# Altium project Microphone-Boards.PrjPcb
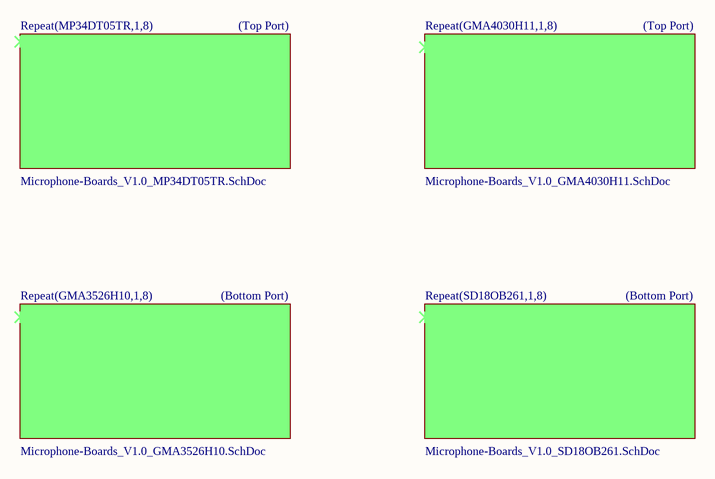
[diagram p0: Microphone-Boards_V1.0.SchDoc]
5 sheets, 320 parts. Net scope: hierarchical (ports join the sheet entries above them; power ports are global).
Board file: Microphone-Boards_V1.0.PcbDoc
Sheets:
  Microphone-Boards_V1.0.SchDoc
    MP34DT05TR1 = Microphone-Boards_V1.0_MP34DT05TR.SchDoc
    MP34DT05TR2 = Microphone-Boards_V1.0_MP34DT05TR.SchDoc
    MP34DT05TR3 = Microphone-Boards_V1.0_MP34DT05TR.SchDoc
    MP34DT05TR4 = Microphone-Boards_V1.0_MP34DT05TR.SchDoc
    MP34DT05TR5 = Microphone-Boards_V1.0_MP34DT05TR.SchDoc
    MP34DT05TR6 = Microphone-Boards_V1.0_MP34DT05TR.SchDoc
    MP34DT05TR7 = Microphone-Boards_V1.0_MP34DT05TR.SchDoc
    MP34DT05TR8 = Microphone-Boards_V1.0_MP34DT05TR.SchDoc
    GMA3526H101 = Microphone-Boards_V1.0_GMA3526H10.SchDoc
    GMA3526H102 = Microphone-Boards_V1.0_GMA3526H10.SchDoc
    GMA3526H103 = Microphone-Boards_V1.0_GMA3526H10.SchDoc
    GMA3526H104 = Microphone-Boards_V1.0_GMA3526H10.SchDoc
    GMA3526H105 = Microphone-Boards_V1.0_GMA3526H10.SchDoc
    GMA3526H106 = Microphone-Boards_V1.0_GMA3526H10.SchDoc
    GMA3526H107 = Microphone-Boards_V1.0_GMA3526H10.SchDoc
    GMA3526H108 = Microphone-Boards_V1.0_GMA3526H10.SchDoc
    GMA4030H111 = Microphone-Boards_V1.0_GMA4030H11.SchDoc
    GMA4030H112 = Microphone-Boards_V1.0_GMA4030H11.SchDoc
    GMA4030H113 = Microphone-Boards_V1.0_GMA4030H11.SchDoc
    GMA4030H114 = Microphone-Boards_V1.0_GMA4030H11.SchDoc
    GMA4030H115 = Microphone-Boards_V1.0_GMA4030H11.SchDoc
    GMA4030H116 = Microphone-Boards_V1.0_GMA4030H11.SchDoc
    GMA4030H117 = Microphone-Boards_V1.0_GMA4030H11.SchDoc
    GMA4030H118 = Microphone-Boards_V1.0_GMA4030H11.SchDoc
    SD18OB2611 = Microphone-Boards_V1.0_SD18OB261.SchDoc
    SD18OB2612 = Microphone-Boards_V1.0_SD18OB261.SchDoc
    SD18OB2613 = Microphone-Boards_V1.0_SD18OB261.SchDoc
    SD18OB2614 = Microphone-Boards_V1.0_SD18OB261.SchDoc
    SD18OB2615 = Microphone-Boards_V1.0_SD18OB261.SchDoc
    SD18OB2616 = Microphone-Boards_V1.0_SD18OB261.SchDoc
    SD18OB2617 = Microphone-Boards_V1.0_SD18OB261.SchDoc
    SD18OB2618 = Microphone-Boards_V1.0_SD18OB261.SchDoc

## Sheet Microphone-Boards_V1.0.SchDoc: Microphone-Boards
size A4; PageSetup: Record=PageOptions|CenterHorizontal=True|CenterVertical=True|PrintScale=0.97|XCorrection=1.00|YCorrection=1.00|PrintKind=0|BorderSize=5000000|LeftOffset=0|BottomOffset=0|Orientation=2|PaperLength=1000|PaperWidth=1000|Scale=100|PaperSource=7|PrintQuality=-3|MediaType=1|DitherType=10|PrintScaleMode=1|PaperKind=A4|PaperIndex=9; Organization: Ostschweizer Fachhochschule; Address2: Florian Baumgartner & Alain Keller; Address3: florian.baumgartner@ost.ch; DocumentNumber: 1; Revision: V1.0; SheetNumber: 1; SheetTotal: 5; Author: Florian Baumgartner & Alain Keller; Subtitle: Overview

### Sub-sheets
Repeat(GMA3526H10,1,8) = Microphone-Boards_V1.0_GMA3526H10.SchDoc: REPEAT(M)
Repeat(GMA4030H11,1,8) = Microphone-Boards_V1.0_GMA4030H11.SchDoc: REPEAT(M)
Repeat(MP34DT05TR,1,8) = Microphone-Boards_V1.0_MP34DT05TR.SchDoc: REPEAT(M)
Repeat(SD18OB261,1,8) = Microphone-Boards_V1.0_SD18OB261.SchDoc: REPEAT(M)

### Notes on the sheet
- (Top Port)
- (Bottom Port)
- Title
- Author:
- Subtitle
- Date:
- Rev:
- File:
- Sheet
- of

## Sheet Microphone-Boards_V1.0_MP34DT05TR.SchDoc: Microphone-Boards
size A4; PageSetup: Record=PageOptions|CenterHorizontal=True|CenterVertical=True|PrintScale=0.97|XCorrection=1.00|YCorrection=1.00|PrintKind=0|BorderSize=5000000|LeftOffset=0|BottomOffset=0|Orientation=2|PaperLength=1000|PaperWidth=1000|Scale=100|PaperSource=7|PrintQuality=-3|MediaType=1|DitherType=10|PrintScaleMode=1|PaperKind=A4|PaperIndex=9; Organization: Ostschweizer Fachhochschule; Address2: Florian Baumgartner & Alain Keller; Address3: florian.baumgartner@ost.ch; DocumentNumber: 1; Revision: V1.0; SheetNumber: 2; SheetTotal: 5; Author: Florian Baumgartner & Alain Keller; Subtitle: MP34DT05TR-A (Top Port)
Used 8 times, as channels MP34DT05TR1, MP34DT05TR2, MP34DT05TR3, MP34DT05TR4, MP34DT05TR5, MP34DT05TR6, MP34DT05TR7, MP34DT05TR8. Parts and nets are listed once, with the designators drawn on the sheet.
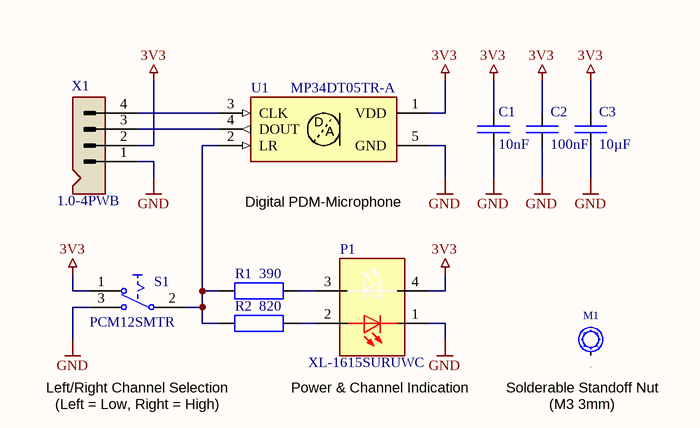
[diagram p1: Microphone-Boards_V1.0_MP34DT05TR.SchDoc]

### Parts
C1  10nF  [SMD Keramikkondensator 0603]
C2  100nF  [SMD Keramikkondensator 0603]
C3  10µF  [SMD Keramikkondensator 1206]
M1  SMTSO-M3-3ET  [SMD Solder-Nut (M3 3mm)]  (value not drawn)
P1  XL-1615SURUWC  [SMD LED 0606]
R1  390  [SMD Widerstand 0603]
R2  820  [SMD Widerstand 0603]
S1  PCM12SMTR  [SMD Switch SPDT (PCM12SMTR)]
U1  MP34DT05TR-A  [SMD Microphone (MP34DT05TR-A)]
X1  1.0-4PWB  [SMD Connector (SM04B-SRSS-TB)]

### Ports
M

### Nets
3V3: C1.2 C2.2 C3.2 P1.4(WA) S1.1(NC1) U1.1(VDD) X1.2
GND: C1.1 C2.1 C3.1 P1.1(RC) S1.3(NO1) U1.5(GND) X1.1
M: M1.1 ; port M
NetP1_2: P1.2(RA) R2.2
NetP1_3: P1.3(WC) R1.2
NetR1_1: R1.1 R2.1 S1.2(COMMON1) U1.2(LR)
NetU1_3: U1.3(CLK) X1.4
NetU1_4: U1.4(DOUT) X1.3

### Channels
MP34DT05TR1: designators end in A; ports M=NetM1A_1
MP34DT05TR2: designators end in B; ports M=NetM1B_1
MP34DT05TR3: designators end in C; ports M=NetM1C_1
MP34DT05TR4: designators end in D; ports M=NetM1D_1
MP34DT05TR5: designators end in E; ports M=NetM1E_1
MP34DT05TR6: designators end in F; ports M=NetM1F_1
MP34DT05TR7: designators end in G; ports M=NetM1G_1
MP34DT05TR8: designators end in H; ports M=NetM1H_1

### Notes on the sheet
- (near U1) Digital PDM-Microphone
- Left/Right Channel Selection
- Power & Channel Indication
- (near M1) Solderable Standoff Nut
- (Left = Low, Right = High)
- (near M1) (M3 3mm)
- Title
- Author:
- Subtitle
- Date:
- Rev:
- File:
- Sheet
- of
- (in symbol U-MP34DT05TR-A) D; A

### Library data of the parts
C1 = C-CAPACITOR: CAP-MK; Component Description: Multilayer Ceramic Capacitors; Component Value: 10nF 50V; Digikey: 445-5662-1-ND; Farnell: 2346966; Mouser: 77-VJ0603V103ZXAPBC; JLC-Parts: C57112; Unit Price: 0.01
C2 = E6 - 100nF: SMD Ceramic Capacitor E6; Component Value: 100nF 50V; Component Description: Multilayer Ceramic Capacitors MLCC; ComponentLink1Description: Datasheet; ComponentLink1URL: https://datasheet.lcsc.com/lcsc/1809301912_YAGEO-CC0603KRX7R9BB104_C14663.pdf; Digikey: 445-6899-1-ND; Farnell: 2210822; JLC-Parts: C14663; Mouser: 810-CGA2B3X7R1H104K; Unit Price: 0.01
C3 = E6 - 10uF: SMD Ceramic Capacitor E6; Component Value: 10µF 50V; Component Description: Multilayer Ceramic Capacitors MLCC; ComponentLink1Description: Datasheet; ComponentLink1URL: https://datasheet.lcsc.com/lcsc/1810191219_Samsung-Electro-Mechanics-CL10A106KP8NNNC_C19702.pdf; Digikey: 587-3258-1-ND; Farnell: 2113070; JLC-Parts: C13585; Mouser: 963-LMK107BBJ106MALT; Unit Price: 0.01
M1 = M-Spacer_M3_3mm: Solderable Standoff Nut; Component Value: M3 3mm; Mouser: 153-SMTSO-M3-3ET; Component Description: Solderable Standoff Nut; Unit Price: 0.05; JLC-Parts: C2915308; ComponentLink1Description: Datasheet; ComponentLink1URL: https://datasheet.lcsc.com/lcsc/2112061830_Sinhoo-SMTSO3030CTJ_C2915308.pdf
P1 = P-XL-1615SURUWC: LED Red/White; ComponentLink1Description: Datasheet; ComponentLink1URL: https://datasheet.lcsc.com/lcsc/2211030000_XINGLIGHT-XL-1615SURUWC_C965837.pdf; JLC-Parts: C965837; Component Description: LED Red/White; Component Value: XL-1615SURUWC; Unit Price: 0.02
R1 = R-RESISTOR: SMD-Widerstand 1/4W; Component Description: Thick Film Chip Resistor; Component Value: 390 (75V, 100mW, 1%); Digikey: P390HCT-ND; Farnell: 2303111; Mouser: 667-ERJ-3EKF3900V; JLC-Parts: C23151; Unit Price: 0.06
R2 = R-RESISTOR: SMD-Widerstand 1/4W; Component Description: Thick Film Chip Resistor; Component Value: 820 (75V, 100mW, 1%); Digikey: P820HCT-ND; Farnell: 2303136; Mouser: 667-ERJ-3EKF8200V; JLC-Parts: C23253; Unit Price: 0.06
S1 = S-PCM12SMTR: Miniature Slide Switch; aliExpress: 33002042977; Component Value: PCM12SMTR (SPDT); Digikey: 401-2016-1-ND; Mouser: 611-PCM12SMTR; Farnell: 9575146; ComponentLink1Description: Datasheet; ComponentLink1URL: https://datasheet.lcsc.com/lcsc/1912111437_SHOU-HAN-MSK12C02_C431540.pdf; JLC-Parts: C431540; Component Description: Miniature Slide Switch; Unit Price: 0.04
U1 = U-MP34DT05TR-A: Digital PDM MEMS Microphone (Top Port); Digikey: 497-17809-1-ND; Farnell: 2851942; Mouser: 511-MP34DT05TR-A; ComponentLink1Description: Datasheet; ComponentLink1URL: https://datasheet.lcsc.com/lcsc/2106070037_STMicroelectronics-MP34DT05TR-A_C2688664.pdf; Component Description: Digital PDM MEMS Microphone (Top Port); Component Value: MP34DT05TR-A; JLC-Parts: C2688664; Unit Price: 1.50
X1 = X-Stiftleiste (4-Fach): Wire To Board Connector (1x4P 1.0mm); Digikey: 455-SM04B-SRSS-TBCT-ND; Farnell: 1830839; Component Description: Wire To Board Connector (1x4P 1.0mm); Component Value: 1.0-4PWB; JLC-Parts: C2905006; Unit Price: 0.03; ComponentLink1Description: Datasheet; ComponentLink1URL: https://datasheet.lcsc.com/lcsc/2111080930_DEALON-1-0-4PWB_C2905006.pdf

## Sheet Microphone-Boards_V1.0_GMA3526H10.SchDoc: Microphone-Boards
size A4; PageSetup: Record=PageOptions|CenterHorizontal=True|CenterVertical=True|PrintScale=0.97|XCorrection=1.00|YCorrection=1.00|PrintKind=0|BorderSize=5000000|LeftOffset=0|BottomOffset=0|Orientation=2|PaperLength=1000|PaperWidth=1000|Scale=100|PaperSource=7|PrintQuality=-3|MediaType=1|DitherType=10|PrintScaleMode=1|PaperKind=A4|PaperIndex=9; Organization: Ostschweizer Fachhochschule; Address2: Florian Baumgartner & Alain Keller; Address3: florian.baumgartner@ost.ch; DocumentNumber: 1; Revision: V1.0; SheetNumber: 3; SheetTotal: 5; Author: Florian Baumgartner & Alain Keller; Subtitle: GMA3526H10-B26 (Bottom Port)
Used 8 times, as channels GMA3526H101, GMA3526H102, GMA3526H103, GMA3526H104, GMA3526H105, GMA3526H106, GMA3526H107, GMA3526H108. Parts and nets are listed once, with the designators drawn on the sheet.
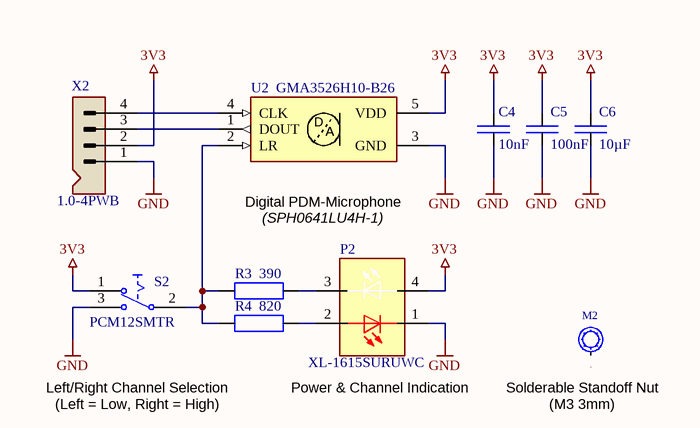
[diagram p2: Microphone-Boards_V1.0_GMA3526H10.SchDoc]

### Parts
C4  10nF  [SMD Keramikkondensator 0603]
C5  100nF  [SMD Keramikkondensator 0603]
C6  10µF  [SMD Keramikkondensator 1206]
M2  SMTSO-M3-3ET  [SMD Solder-Nut (M3 3mm)]  (value not drawn)
P2  XL-1615SURUWC  [SMD LED 0606]
R3  390  [SMD Widerstand 0603]
R4  820  [SMD Widerstand 0603]
S2  PCM12SMTR  [SMD Switch SPDT (PCM12SMTR)]
U2  GMA3526H10-B26  [SMD Microphone (GMA3526H10-B26)]
X2  1.0-4PWB  [SMD Connector (SM04B-SRSS-TB)]

### Ports
M

### Nets
3V3: C4.2 C5.2 C6.2 P2.4(WA) S2.1(NC1) U2.5(VDD) X2.2
GND: C4.1 C5.1 C6.1 P2.1(RC) S2.3(NO1) U2.3(GND) X2.1
M: M2.1 ; port M
NetP2_2: P2.2(RA) R4.2
NetP2_3: P2.3(WC) R3.2
NetR3_1: R3.1 R4.1 S2.2(COMMON1) U2.2(LR)
NetU2_1: U2.1(DOUT) X2.3
NetU2_4: U2.4(CLK) X2.4

### Channels
GMA3526H101: designators end in A; ports M=NetM2A_1
GMA3526H102: designators end in B; ports M=NetM2B_1
GMA3526H103: designators end in C; ports M=NetM2C_1
GMA3526H104: designators end in D; ports M=NetM2D_1
GMA3526H105: designators end in E; ports M=NetM2E_1
GMA3526H106: designators end in F; ports M=NetM2F_1
GMA3526H107: designators end in G; ports M=NetM2G_1
GMA3526H108: designators end in H; ports M=NetM2H_1

### Notes on the sheet
- (near U2) Digital PDM-Microphone
- (SPH0641LU4H-1)
- Left/Right Channel Selection
- Power & Channel Indication
- (near M2) Solderable Standoff Nut
- (Left = Low, Right = High)
- (near M2) (M3 3mm)
- Title
- Author:
- Subtitle
- Date:
- Rev:
- File:
- Sheet
- of
- (in symbol U-GMA3526H10-B26) D; A

### Library data of the parts
C4 = C-CAPACITOR: as C1 on sheet Microphone-Boards_V1.0_MP34DT05TR; Digikey: 445-5662-1-ND; Farnell: 2346966; Mouser: 77-VJ0603V103ZXAPBC; JLC-Parts: C57112; Unit Price: 0.01
C5 = E6 - 100nF: as C2 on sheet Microphone-Boards_V1.0_MP34DT05TR; ComponentLink1Description: Datasheet; ComponentLink1URL: https://datasheet.lcsc.com/lcsc/1809301912_YAGEO-CC0603KRX7R9BB104_C14663.pdf; Digikey: 445-6899-1-ND; Farnell: 2210822; JLC-Parts: C14663; Mouser: 810-CGA2B3X7R1H104K; Unit Price: 0.01
C6 = E6 - 10uF: as C3 on sheet Microphone-Boards_V1.0_MP34DT05TR; ComponentLink1Description: Datasheet; ComponentLink1URL: https://datasheet.lcsc.com/lcsc/1810191219_Samsung-Electro-Mechanics-CL10A106KP8NNNC_C19702.pdf; Digikey: 587-3258-1-ND; Farnell: 2113070; JLC-Parts: C13585; Mouser: 963-LMK107BBJ106MALT; Unit Price: 0.01
M2 = M-Spacer_M3_3mm: as M1 on sheet Microphone-Boards_V1.0_MP34DT05TR; Mouser: 153-SMTSO-M3-3ET; Component Description: Solderable Standoff Nut; Unit Price: 0.05; JLC-Parts: C2915308; ComponentLink1Description: Datasheet; ComponentLink1URL: https://datasheet.lcsc.com/lcsc/2112061830_Sinhoo-SMTSO3030CTJ_C2915308.pdf
P2 = P-XL-1615SURUWC: LED Red/White; ComponentLink1Description: Datasheet; ComponentLink1URL: https://datasheet.lcsc.com/lcsc/2211030000_XINGLIGHT-XL-1615SURUWC_C965837.pdf; JLC-Parts: C965837; Component Description: LED Red/White; Component Value: XL-1615SURUWC; Unit Price: 0.02
R3 = R-RESISTOR: as R1 on sheet Microphone-Boards_V1.0_MP34DT05TR; Digikey: P390HCT-ND; Farnell: 2303111; Mouser: 667-ERJ-3EKF3900V; JLC-Parts: C23151; Unit Price: 0.06
R4 = R-RESISTOR: as R2 on sheet Microphone-Boards_V1.0_MP34DT05TR; Digikey: P820HCT-ND; Farnell: 2303136; Mouser: 667-ERJ-3EKF8200V; JLC-Parts: C23253; Unit Price: 0.06
S2 = S-PCM12SMTR: as S1 on sheet Microphone-Boards_V1.0_MP34DT05TR; Digikey: 401-2016-1-ND; Mouser: 611-PCM12SMTR; Farnell: 9575146; ComponentLink1Description: Datasheet; ComponentLink1URL: https://datasheet.lcsc.com/lcsc/1912111437_SHOU-HAN-MSK12C02_C431540.pdf; JLC-Parts: C431540; Component Description: Miniature Slide Switch; Unit Price: 0.04
U2 = U-GMA3526H10-B26: Digital PDM MEMS Microphone (Bottom Port); Digikey: 423-1402-1-ND; Mouser: 721-SPH0641LU4H-1; ComponentLink1Description: Datasheet; ComponentLink1URL: https://datasheet.lcsc.com/lcsc/2004081814_INGHAi-GMA3526H10-B26_C498192.pdf; Component Description: Digital PDM MEMS Microphone (Bottom Port); Component Value: GMA3526H10-B26; JLC-Parts: C498192; Unit Price: 1.06
X2 = X-Stiftleiste (4-Fach): Wire To Board Connector (1x4P 1.0mm); Digikey: 455-SM04B-SRSS-TBCT-ND; Farnell: 1830839; Component Description: Wire To Board Connector (1x4P 1.0mm); Component Value: 1.0-4PWB; JLC-Parts: C2905006; Unit Price: 0.03; ComponentLink1Description: Datasheet; ComponentLink1URL: https://datasheet.lcsc.com/lcsc/2111080930_DEALON-1-0-4PWB_C2905006.pdf

## Sheet Microphone-Boards_V1.0_GMA4030H11.SchDoc: Microphone-Boards
size A4; PageSetup: Record=PageOptions|CenterHorizontal=True|CenterVertical=True|PrintScale=0.97|XCorrection=1.00|YCorrection=1.00|PrintKind=0|BorderSize=5000000|LeftOffset=0|BottomOffset=0|Orientation=2|PaperLength=1000|PaperWidth=1000|Scale=100|PaperSource=7|PrintQuality=-3|MediaType=1|DitherType=10|PrintScaleMode=1|PaperKind=A4|PaperIndex=9; Organization: Ostschweizer Fachhochschule; Address2: Florian Baumgartner & Alain Keller; Address3: florian.baumgartner@ost.ch; DocumentNumber: 1; Revision: V1.0; SheetNumber: 4; SheetTotal: 5; Author: Florian Baumgartner & Alain Keller; Subtitle: GMA4030H11-F26 (Top Port)
Used 8 times, as channels GMA4030H111, GMA4030H112, GMA4030H113, GMA4030H114, GMA4030H115, GMA4030H116, GMA4030H117, GMA4030H118. Parts and nets are listed once, with the designators drawn on the sheet.
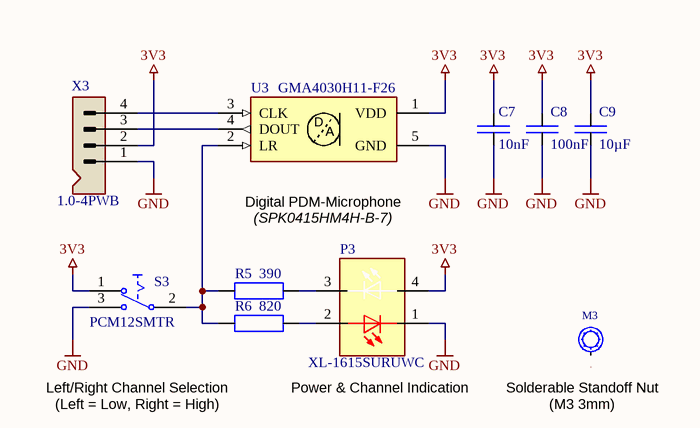
[diagram p3: Microphone-Boards_V1.0_GMA4030H11.SchDoc]

### Parts
C7  10nF  [SMD Keramikkondensator 0603]
C8  100nF  [SMD Keramikkondensator 0603]
C9  10µF  [SMD Keramikkondensator 1206]
M3  SMTSO-M3-3ET  [SMD Solder-Nut (M3 3mm)]  (value not drawn)
P3  XL-1615SURUWC  [SMD LED 0606]
R5  390  [SMD Widerstand 0603]
R6  820  [SMD Widerstand 0603]
S3  PCM12SMTR  [SMD Switch SPDT (PCM12SMTR)]
U3  GMA4030H11-F26  [SMD Microphone (GMA4030H11-F26)]
X3  1.0-4PWB  [SMD Connector (SM04B-SRSS-TB)]

### Ports
M

### Nets
3V3: C7.2 C8.2 C9.2 P3.4(WA) S3.1(NC1) U3.1(VDD) X3.2
GND: C7.1 C8.1 C9.1 P3.1(RC) S3.3(NO1) U3.5(GND) X3.1
M: M3.1 ; port M
NetP3_2: P3.2(RA) R6.2
NetP3_3: P3.3(WC) R5.2
NetR5_1: R5.1 R6.1 S3.2(COMMON1) U3.2(LR)
NetU3_3: U3.3(CLK) X3.4
NetU3_4: U3.4(DOUT) X3.3

### Channels
GMA4030H111: designators end in A; ports M=NetM3A_1
GMA4030H112: designators end in B; ports M=NetM3B_1
GMA4030H113: designators end in C; ports M=NetM3C_1
GMA4030H114: designators end in D; ports M=NetM3D_1
GMA4030H115: designators end in E; ports M=NetM3E_1
GMA4030H116: designators end in F; ports M=NetM3F_1
GMA4030H117: designators end in G; ports M=NetM3G_1
GMA4030H118: designators end in H; ports M=NetM3H_1

### Notes on the sheet
- (near U3) Digital PDM-Microphone
- (SPK0415HM4H-B-7)
- Left/Right Channel Selection
- Power & Channel Indication
- (near M3) Solderable Standoff Nut
- (Left = Low, Right = High)
- (near M3) (M3 3mm)
- Title
- Author:
- Subtitle
- Date:
- Rev:
- File:
- Sheet
- of
- (in symbol U-GMA4030H11-F26) D; A

### Library data of the parts
C7 = C-CAPACITOR: as C1 on sheet Microphone-Boards_V1.0_MP34DT05TR; Digikey: 445-5662-1-ND; Farnell: 2346966; Mouser: 77-VJ0603V103ZXAPBC; JLC-Parts: C57112; Unit Price: 0.01
C8 = E6 - 100nF: as C2 on sheet Microphone-Boards_V1.0_MP34DT05TR; ComponentLink1Description: Datasheet; ComponentLink1URL: https://datasheet.lcsc.com/lcsc/1809301912_YAGEO-CC0603KRX7R9BB104_C14663.pdf; Digikey: 445-6899-1-ND; Farnell: 2210822; JLC-Parts: C14663; Mouser: 810-CGA2B3X7R1H104K; Unit Price: 0.01
C9 = E6 - 10uF: as C3 on sheet Microphone-Boards_V1.0_MP34DT05TR; ComponentLink1Description: Datasheet; ComponentLink1URL: https://datasheet.lcsc.com/lcsc/1810191219_Samsung-Electro-Mechanics-CL10A106KP8NNNC_C19702.pdf; Digikey: 587-3258-1-ND; Farnell: 2113070; JLC-Parts: C13585; Mouser: 963-LMK107BBJ106MALT; Unit Price: 0.01
M3 = M-Spacer_M3_3mm: as M1 on sheet Microphone-Boards_V1.0_MP34DT05TR; Mouser: 153-SMTSO-M3-3ET; Component Description: Solderable Standoff Nut; Unit Price: 0.05; JLC-Parts: C2915308; ComponentLink1Description: Datasheet; ComponentLink1URL: https://datasheet.lcsc.com/lcsc/2112061830_Sinhoo-SMTSO3030CTJ_C2915308.pdf
P3 = P-XL-1615SURUWC: LED Red/White; ComponentLink1Description: Datasheet; ComponentLink1URL: https://datasheet.lcsc.com/lcsc/2211030000_XINGLIGHT-XL-1615SURUWC_C965837.pdf; JLC-Parts: C965837; Component Description: LED Red/White; Component Value: XL-1615SURUWC; Unit Price: 0.02
R5 = R-RESISTOR: as R1 on sheet Microphone-Boards_V1.0_MP34DT05TR; Digikey: P390HCT-ND; Farnell: 2303111; Mouser: 667-ERJ-3EKF3900V; JLC-Parts: C23151; Unit Price: 0.06
R6 = R-RESISTOR: as R2 on sheet Microphone-Boards_V1.0_MP34DT05TR; Digikey: P820HCT-ND; Farnell: 2303136; Mouser: 667-ERJ-3EKF8200V; JLC-Parts: C23253; Unit Price: 0.06
S3 = S-PCM12SMTR: as S1 on sheet Microphone-Boards_V1.0_MP34DT05TR; Digikey: 401-2016-1-ND; Mouser: 611-PCM12SMTR; Farnell: 9575146; ComponentLink1Description: Datasheet; ComponentLink1URL: https://datasheet.lcsc.com/lcsc/1912111437_SHOU-HAN-MSK12C02_C431540.pdf; JLC-Parts: C431540; Component Description: Miniature Slide Switch; Unit Price: 0.04
U3 = U-GMA4030H11-F26: Digital PDM MEMS Microphone (Top Port); Digikey: 423-1210-1-ND; Mouser: 721-SPK0415HM4H-B-7; ComponentLink1Description: Datasheet; ComponentLink1URL: https://datasheet.lcsc.com/lcsc/2005071903_INGHAi-GMA4030H11-F26_C498193.pdf; Component Description: Digital PDM MEMS Microphone (Top Port); Component Value: GMA4030H11-F26; JLC-Parts: C498193; Unit Price: 1.11
X3 = X-Stiftleiste (4-Fach): Wire To Board Connector (1x4P 1.0mm); Digikey: 455-SM04B-SRSS-TBCT-ND; Farnell: 1830839; Component Description: Wire To Board Connector (1x4P 1.0mm); Component Value: 1.0-4PWB; JLC-Parts: C2905006; Unit Price: 0.03; ComponentLink1Description: Datasheet; ComponentLink1URL: https://datasheet.lcsc.com/lcsc/2111080930_DEALON-1-0-4PWB_C2905006.pdf

## Sheet Microphone-Boards_V1.0_SD18OB261.SchDoc: Microphone-Boards
size A4; PageSetup: Record=PageOptions|CenterHorizontal=True|CenterVertical=True|PrintScale=0.97|XCorrection=1.00|YCorrection=1.00|PrintKind=0|BorderSize=5000000|LeftOffset=0|BottomOffset=0|Orientation=2|PaperLength=1000|PaperWidth=1000|Scale=100|PaperSource=7|PrintQuality=-3|MediaType=1|DitherType=10|PrintScaleMode=1|PaperKind=A4|PaperIndex=9; Organization: Ostschweizer Fachhochschule; Address2: Florian Baumgartner & Alain Keller; Address3: florian.baumgartner@ost.ch; DocumentNumber: 1; Revision: V1.0; SheetNumber: 5; SheetTotal: 5; Author: Florian Baumgartner & Alain Keller; Subtitle: SD18OB261-060 (Bottom Port)
Used 8 times, as channels SD18OB2611, SD18OB2612, SD18OB2613, SD18OB2614, SD18OB2615, SD18OB2616, SD18OB2617, SD18OB2618. Parts and nets are listed once, with the designators drawn on the sheet.
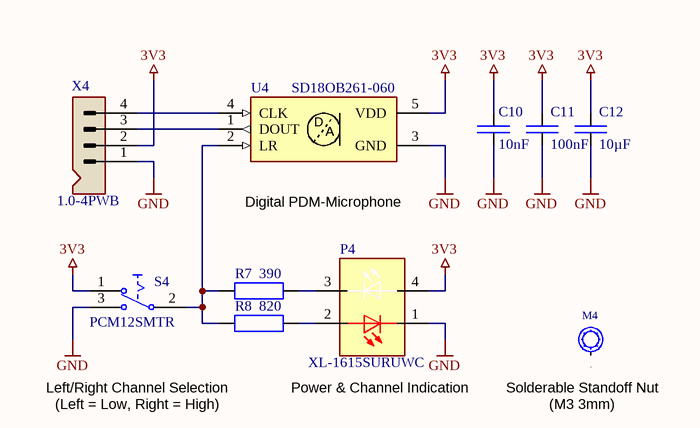
[diagram p4: Microphone-Boards_V1.0_SD18OB261.SchDoc]

### Parts
C10  10nF  [SMD Keramikkondensator 0603]
C11  100nF  [SMD Keramikkondensator 0603]
C12  10µF  [SMD Keramikkondensator 1206]
M4  SMTSO-M3-3ET  [SMD Solder-Nut (M3 3mm)]  (value not drawn)
P4  XL-1615SURUWC  [SMD LED 0606]
R7  390  [SMD Widerstand 0603]
R8  820  [SMD Widerstand 0603]
S4  PCM12SMTR  [SMD Switch SPDT (PCM12SMTR)]
U4  SD18OB261-060  [SMD Microphone (SD18OB261-060)]
X4  1.0-4PWB  [SMD Connector (SM04B-SRSS-TB)]

### Ports
M

### Nets
3V3: C10.2 C11.2 C12.2 P4.4(WA) S4.1(NC1) U4.5(VDD) X4.2
GND: C10.1 C11.1 C12.1 P4.1(RC) S4.3(NO1) U4.3(GND) X4.1
M: M4.1 ; port M
NetP4_2: P4.2(RA) R8.2
NetP4_3: P4.3(WC) R7.2
NetR7_1: R7.1 R8.1 S4.2(COMMON1) U4.2(LR)
NetU4_1: U4.1(DOUT) X4.3
NetU4_4: U4.4(CLK) X4.4

### Channels
SD18OB2611: designators end in A; ports M=NetM4A_1
SD18OB2612: designators end in B; ports M=NetM4B_1
SD18OB2613: designators end in C; ports M=NetM4C_1
SD18OB2614: designators end in D; ports M=NetM4D_1
SD18OB2615: designators end in E; ports M=NetM4E_1
SD18OB2616: designators end in F; ports M=NetM4F_1
SD18OB2617: designators end in G; ports M=NetM4G_1
SD18OB2618: designators end in H; ports M=NetM4H_1

### Notes on the sheet
- (near U4) Digital PDM-Microphone
- Left/Right Channel Selection
- Power & Channel Indication
- (near M4) Solderable Standoff Nut
- (Left = Low, Right = High)
- (near M4) (M3 3mm)
- Title
- Author:
- Subtitle
- Date:
- Rev:
- File:
- Sheet
- of
- (in symbol U-SD18OB261-060) D; A

### Library data of the parts
C10 = C-CAPACITOR: as C1 on sheet Microphone-Boards_V1.0_MP34DT05TR; Digikey: 445-5662-1-ND; Farnell: 2346966; Mouser: 77-VJ0603V103ZXAPBC; JLC-Parts: C57112; Unit Price: 0.01
C11 = E6 - 100nF: as C2 on sheet Microphone-Boards_V1.0_MP34DT05TR; ComponentLink1Description: Datasheet; ComponentLink1URL: https://datasheet.lcsc.com/lcsc/1809301912_YAGEO-CC0603KRX7R9BB104_C14663.pdf; Digikey: 445-6899-1-ND; Farnell: 2210822; JLC-Parts: C14663; Mouser: 810-CGA2B3X7R1H104K; Unit Price: 0.01
C12 = E6 - 10uF: as C3 on sheet Microphone-Boards_V1.0_MP34DT05TR; ComponentLink1Description: Datasheet; ComponentLink1URL: https://datasheet.lcsc.com/lcsc/1810191219_Samsung-Electro-Mechanics-CL10A106KP8NNNC_C19702.pdf; Digikey: 587-3258-1-ND; Farnell: 2113070; JLC-Parts: C13585; Mouser: 963-LMK107BBJ106MALT; Unit Price: 0.01
M4 = M-Spacer_M3_3mm: as M1 on sheet Microphone-Boards_V1.0_MP34DT05TR; Mouser: 153-SMTSO-M3-3ET; Component Description: Solderable Standoff Nut; Unit Price: 0.05; JLC-Parts: C2915308; ComponentLink1Description: Datasheet; ComponentLink1URL: https://datasheet.lcsc.com/lcsc/2112061830_Sinhoo-SMTSO3030CTJ_C2915308.pdf
P4 = P-XL-1615SURUWC: LED Red/White; ComponentLink1Description: Datasheet; ComponentLink1URL: https://datasheet.lcsc.com/lcsc/2211030000_XINGLIGHT-XL-1615SURUWC_C965837.pdf; JLC-Parts: C965837; Component Description: LED Red/White; Component Value: XL-1615SURUWC; Unit Price: 0.02
R7 = R-RESISTOR: as R1 on sheet Microphone-Boards_V1.0_MP34DT05TR; Digikey: P390HCT-ND; Farnell: 2303111; Mouser: 667-ERJ-3EKF3900V; JLC-Parts: C23151; Unit Price: 0.06
R8 = R-RESISTOR: as R2 on sheet Microphone-Boards_V1.0_MP34DT05TR; Digikey: P820HCT-ND; Farnell: 2303136; Mouser: 667-ERJ-3EKF8200V; JLC-Parts: C23253; Unit Price: 0.06
S4 = S-PCM12SMTR: as S1 on sheet Microphone-Boards_V1.0_MP34DT05TR; Digikey: 401-2016-1-ND; Mouser: 611-PCM12SMTR; Farnell: 9575146; ComponentLink1Description: Datasheet; ComponentLink1URL: https://datasheet.lcsc.com/lcsc/1912111437_SHOU-HAN-MSK12C02_C431540.pdf; JLC-Parts: C431540; Component Description: Miniature Slide Switch; Unit Price: 0.04
U4 = U-SD18OB261-060: Digital PDM MEMS Microphone (Bottom Port); Digikey: 4719-SD18OB261-050DKR-ND; ComponentLink1Description: Datasheet; ComponentLink1URL: https://datasheet.lcsc.com/lcsc/2208241200_Goertek-SD18OB261-060_C2895290.pdf; Component Description: Digital PDM MEMS Microphone (Bottom Port); Component Value: SD18OB261-060; JLC-Parts: C2895290; Unit Price: 0.61
X4 = X-Stiftleiste (4-Fach): Wire To Board Connector (1x4P 1.0mm); Digikey: 455-SM04B-SRSS-TBCT-ND; Farnell: 1830839; Component Description: Wire To Board Connector (1x4P 1.0mm); Component Value: 1.0-4PWB; JLC-Parts: C2905006; Unit Price: 0.03; ComponentLink1Description: Datasheet; ComponentLink1URL: https://datasheet.lcsc.com/lcsc/2111080930_DEALON-1-0-4PWB_C2905006.pdf

## Nets that join several sheets
3V3: MP34DT05TR1 (7 pins), MP34DT05TR2 (7 pins), MP34DT05TR3 (7 pins), MP34DT05TR4 (7 pins), MP34DT05TR5 (7 pins), MP34DT05TR6 (7 pins), MP34DT05TR7 (7 pins), MP34DT05TR8 (7 pins), GMA3526H101 (7 pins), GMA3526H102 (7 pins), GMA3526H103 (7 pins), GMA3526H104 (7 pins), GMA3526H105 (7 pins), GMA3526H106 (7 pins), GMA3526H107 (7 pins), GMA3526H108 (7 pins), GMA4030H111 (7 pins), GMA4030H112 (7 pins), GMA4030H113 (7 pins), GMA4030H114 (7 pins), GMA4030H115 (7 pins), GMA4030H116 (7 pins), GMA4030H117 (7 pins), GMA4030H118 (7 pins), SD18OB2611 (7 pins), SD18OB2612 (7 pins), SD18OB2613 (7 pins), SD18OB2614 (7 pins), SD18OB2615 (7 pins), SD18OB2616 (7 pins), SD18OB2617 (7 pins), SD18OB2618 (7 pins)
GND: MP34DT05TR1 (7 pins), MP34DT05TR2 (7 pins), MP34DT05TR3 (7 pins), MP34DT05TR4 (7 pins), MP34DT05TR5 (7 pins), MP34DT05TR6 (7 pins), MP34DT05TR7 (7 pins), MP34DT05TR8 (7 pins), GMA3526H101 (7 pins), GMA3526H102 (7 pins), GMA3526H103 (7 pins), GMA3526H104 (7 pins), GMA3526H105 (7 pins), GMA3526H106 (7 pins), GMA3526H107 (7 pins), GMA3526H108 (7 pins), GMA4030H111 (7 pins), GMA4030H112 (7 pins), GMA4030H113 (7 pins), GMA4030H114 (7 pins), GMA4030H115 (7 pins), GMA4030H116 (7 pins), GMA4030H117 (7 pins), GMA4030H118 (7 pins), SD18OB2611 (7 pins), SD18OB2612 (7 pins), SD18OB2613 (7 pins), SD18OB2614 (7 pins), SD18OB2615 (7 pins), SD18OB2616 (7 pins), SD18OB2617 (7 pins), SD18OB2618 (7 pins)